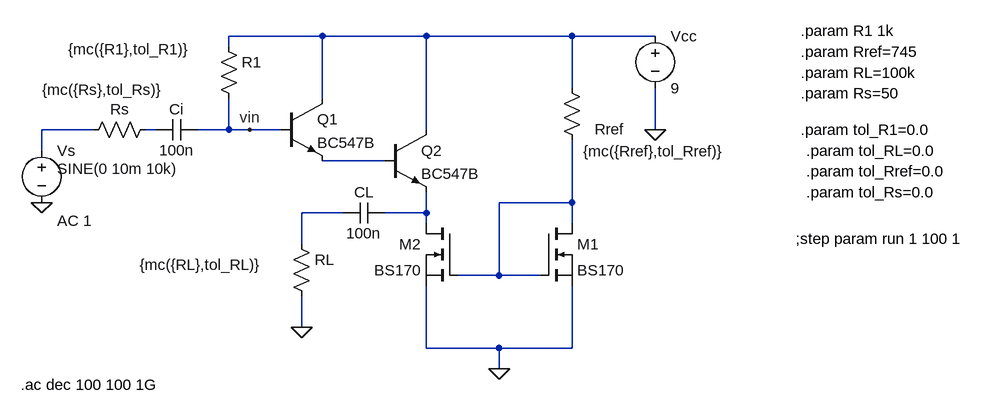
[diagram p0: schematic darlington.asc]
darlington.asc, the LTspice schematic file:
Version 4
SHEET 1 1188 680
WIRE 176 16 32 16
WIRE 336 16 176 16
WIRE 560 16 336 16
WIRE 688 16 560 16
WIRE 32 32 32 16
WIRE 560 96 560 16
WIRE 176 112 176 16
WIRE -176 160 -256 160
WIRE -80 160 -96 160
WIRE 32 160 32 112
WIRE 32 160 -16 160
WIRE 64 160 32 160
WIRE 112 160 64 160
WIRE 336 160 336 16
WIRE 688 160 688 96
WIRE -256 192 -256 160
WIRE 272 208 176 208
WIRE 560 272 560 176
WIRE 560 272 448 272
WIRE 208 288 144 288
WIRE 336 288 336 256
WIRE 336 288 272 288
WIRE 336 304 336 288
WIRE 560 304 560 272
WIRE 144 336 144 288
WIRE 448 384 448 272
WIRE 448 384 384 384
WIRE 512 384 448 384
WIRE 144 464 144 416
WIRE 336 496 336 400
WIRE 448 496 336 496
WIRE 560 496 560 400
WIRE 560 496 448 496
WIRE 448 528 448 496
FLAG 688 160 0
FLAG -256 272 0
FLAG 64 160 vin
FLAG 448 528 0
FLAG 144 464 0
SYMBOL npn 112 112 R0
SYMATTR InstName Q1
SYMATTR Value BC547B
SYMBOL npn 272 160 R0
SYMATTR InstName Q2
SYMATTR Value BC547B
SYMBOL res 16 16 R0
WINDOW 3 -231 20 Left 2
SYMATTR Value {mc({R1},tol_R1)}
SYMATTR InstName R1
SYMBOL voltage 688 0 R0
WINDOW 123 0 0 Left 0
WINDOW 39 0 0 Left 0
SYMATTR InstName Vcc
SYMATTR Value 9
SYMBOL cap -16 144 R90
WINDOW 0 0 32 VBottom 2
WINDOW 3 32 32 VTop 2
SYMATTR InstName Ci
SYMATTR Value 100n
SYMBOL voltage -256 176 R0
WINDOW 123 24 124 Left 2
WINDOW 39 0 0 Left 0
WINDOW 3 24 44 Left 2
SYMATTR Value2 AC 1
SYMATTR Value SINE(0 10m 10k)
SYMATTR InstName Vs
SYMBOL res -80 144 R90
WINDOW 0 0 56 VBottom 2
WINDOW 3 -30 82 VBottom 2
SYMATTR InstName Rs
SYMATTR Value {mc({Rs},tol_Rs)}
SYMBOL nmos 512 304 R0
SYMATTR InstName M1
SYMATTR Value BS170
SYMBOL nmos 384 304 M0
SYMATTR InstName M2
SYMATTR Value BS170
SYMBOL res 544 80 R0
WINDOW 0 51 79 Left 2
WINDOW 3 33 113 Left 2
SYMATTR InstName Rref
SYMATTR Value {mc({Rref},tol_Rref)}
SYMBOL cap 272 272 R90
WINDOW 0 0 32 VBottom 2
WINDOW 3 32 32 VTop 2
SYMATTR InstName CL
SYMATTR Value 100n
SYMBOL res 128 320 R0
WINDOW 3 -233 48 Left 2
SYMATTR Value {mc({RL},tol_RL)}
SYMATTR InstName RL
TEXT -288 552 Left 2 !.ac dec 100 100 1G
TEXT 912 8 Left 2 !.param R1 1k
TEXT 912 40 Left 2 !.param Rref=745
TEXT 912 72 Left 2 !.param RL=100k
TEXT 912 104 Left 2 !.param Rs=50
TEXT 912 160 Left 2 !.param tol_R1=0.0
TEXT 920 192 Left 2 !.param tol_RL=0.0
TEXT 920 224 Left 2 !.param tol_Rref=0.0
TEXT 920 256 Left 2 !.param tol_Rs=0.0
TEXT 904 328 Left 2 !;step param run 1 100 1

The netlist it stands for:
* darlington.asc
Q1 N001 vin N004 0 BC547B
Q2 N001 N004 N007 0 BC547B
R1 N001 vin {mc({R1},tol_R1)}
Vcc N001 0 9
Ci vin N003 100n
Vs N002 0 SINE(0 10m 10k) AC 1
Rs N003 N002 {mc({Rs},tol_Rs)}
M1 N005 N005 0 0 BS170
M2 N007 N005 0 0 BS170
Rref N001 N005 {mc({Rref},tol_Rref)}
CL N007 N006 100n
RL N006 0 {mc({RL},tol_RL)}
.model NPN NPN
.model PNP PNP
.lib standard.bjt
.model NMOS NMOS
.model PMOS PMOS
.lib standard.mos
.ac dec 100 100 1G
.param R1 1k
.param Rref=745
.param RL=100k
.param Rs=50
.param tol_R1=0.0
.param tol_RL=0.0
.param tol_Rref=0.0
.param tol_Rs=0.0
;step param run 1 100 1
.backanno
.end